# EAGLE design Toggle_Switch_Hub (EAGLE 7.6.0)

## Sheet 1 of 2
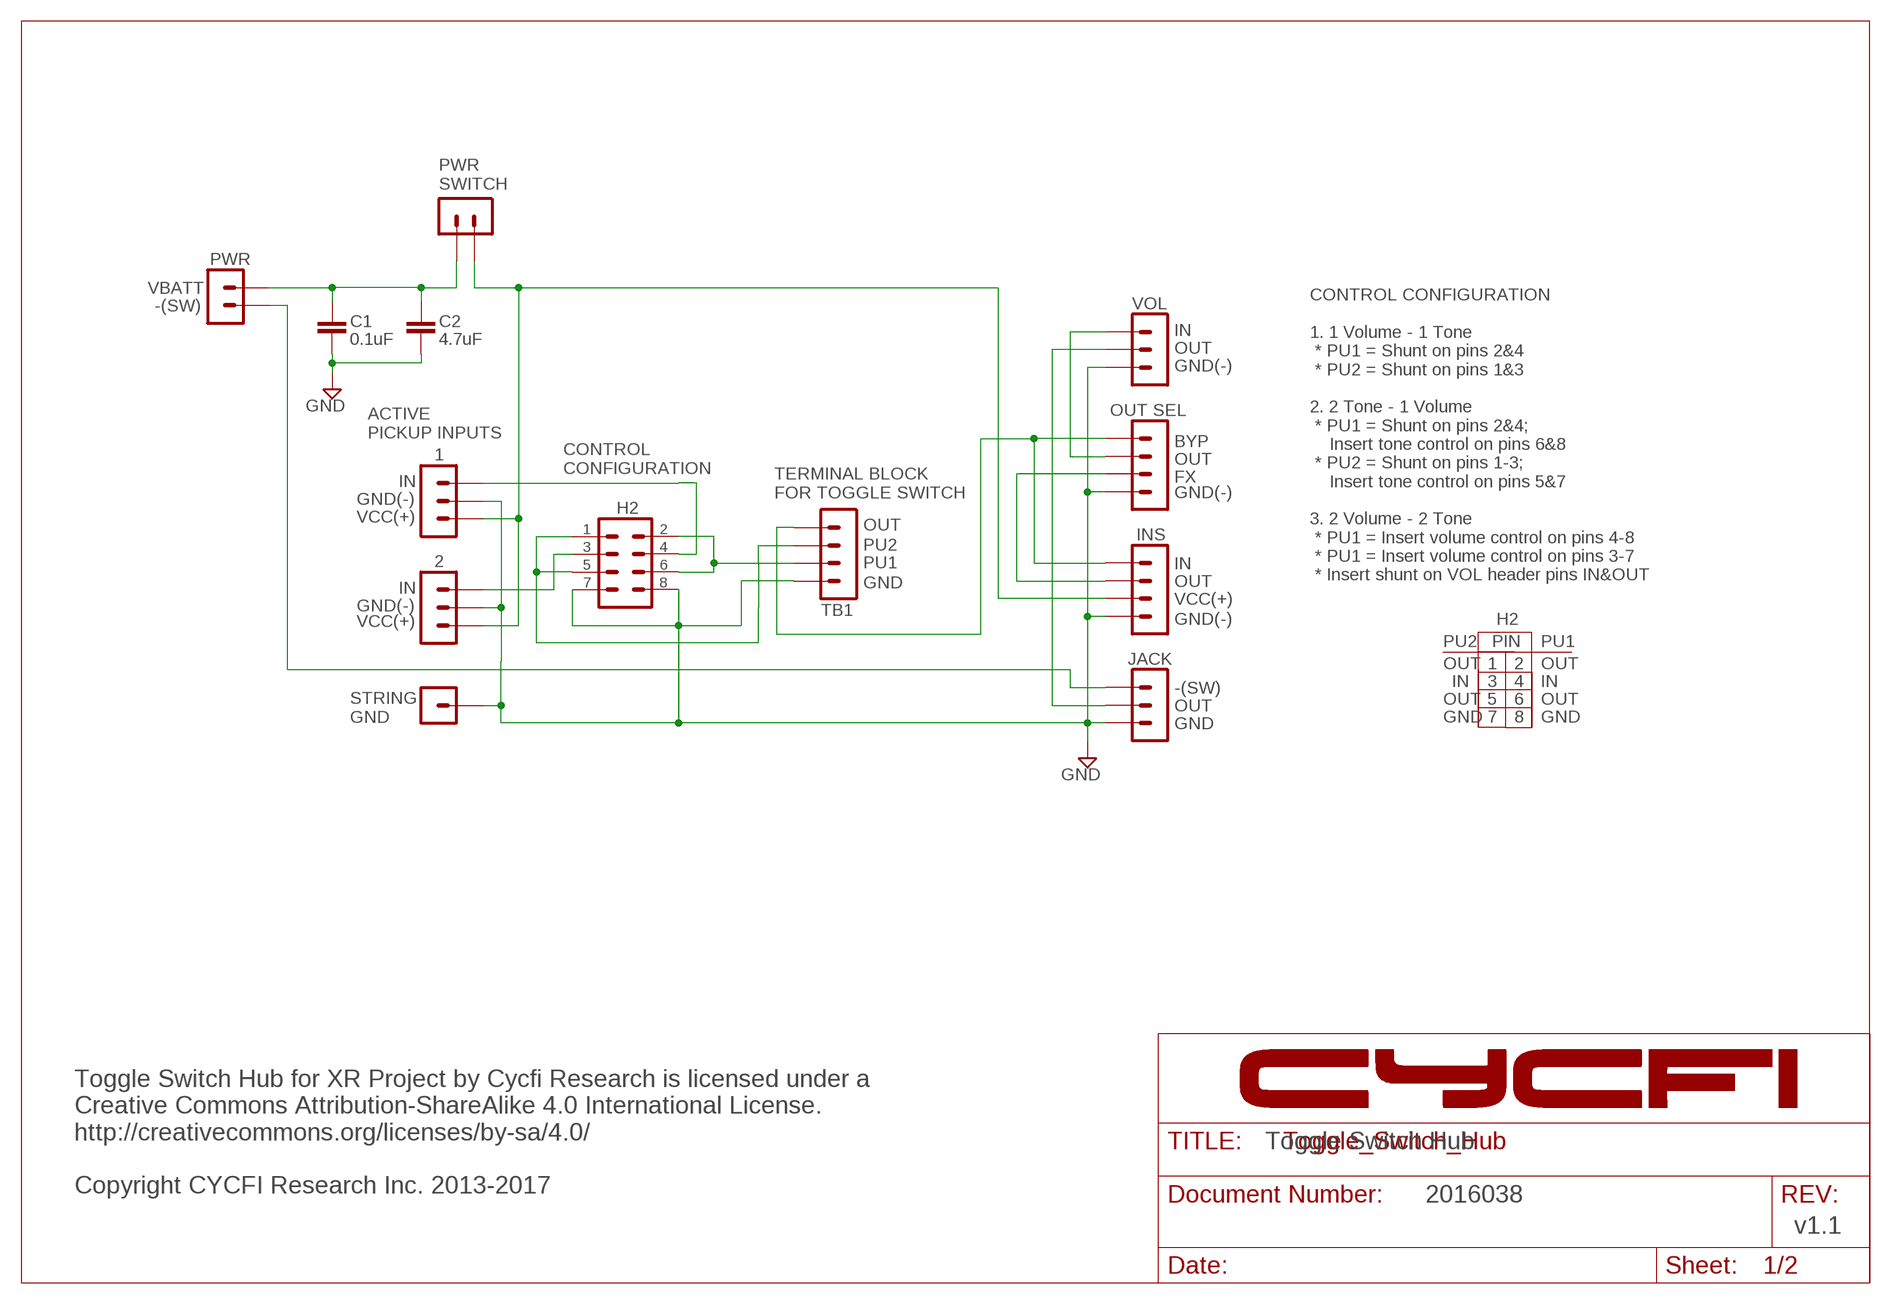
[diagram p0: schematic, sheet 1]

### Parts
C1  0.1uF  C-EUC0603  [C0603]
C2  4.7uF  C-EUC0603  [C0603]
H2  MA04-2  [MA04-2]
TB1  282837-4_TERMINAL_BLOCK  [TERMINAL_BLOCK_4P_5.08MM]

### Nets
BYP: TB1.P$4 ; also sheet 2
GND: C1.2 C2.2 H2.7 H2.8 TB1.P$1 ; also sheet 2
N$6: H2.2 H2.6 TB1.P$2
N$8: H2.1 H2.5 TB1.P$3
PU1: H2.4 ; also sheet 2
PU2: H2.3 ; also sheet 2
VCC: C1.1 C2.1 ; also sheet 2

### Notes on the sheet
- PWR
  SWITCH
- PWR
- VBATT
- -(SW) | VOL
- IN
- OUT
- GND(-)
- OUT SEL
- ACTIVE
  PICKUP INPUTS
- BYP
- 1 | OUT
- CONTROL 
  CONFIGURATION
- IN | FX
- TERMINAL BLOCK
  FOR TOGGLE SWITCH
- GND(-)
- GND(-)
- VCC(+) | OUT
- PU2 | INS
- PU1
- 2 | IN
- GND
- CONTROL CONFIGURATION
  
  1. 1 Volume - 1 Tone 
   * PU1 = Shunt on pins 2&4
   * PU2 = Shunt on pins 1&3
  
  2. 2 Tone - 1 Volume
   * PU1 = Shunt on pins 2&4; 
      Insert tone control on pins 6&8 
   * PU2 = Shunt on pins 1-3;
      Insert tone control on pins 5&7
  
  3. 2 Volume - 2 Tone
   * PU1 = Insert volume control on pins 4-8 
   * PU1 = Insert volume control on pins 3-7
   * Insert shunt on VOL header pins IN&OUT
- OUT
- IN
- VCC(+)
- GND(-) | TB1
- VCC(+) | GND(-) | H2
- PU2 | PIN | PU1
- JACK | OUT | 1 | 2 | OUT
- IN | 3 | 4 | IN
- -(SW)
- OUT | 5 | 6 | OUT
- OUT
- STRING 
  GND
- GND | 7 | 8 | GND
- GND
- Toggle Switch Hub
- Toggle Switch Hub for XR Project by Cycfi Research is licensed under a 
  Creative Commons Attribution-ShareAlike 4.0 International License. 
  http://creativecommons.org/licenses/by-sa/4.0/ 
  
  Copyright CYCFI Research Inc. 2013-2017
- 2016038
- v1.1

## Sheet 2 of 2
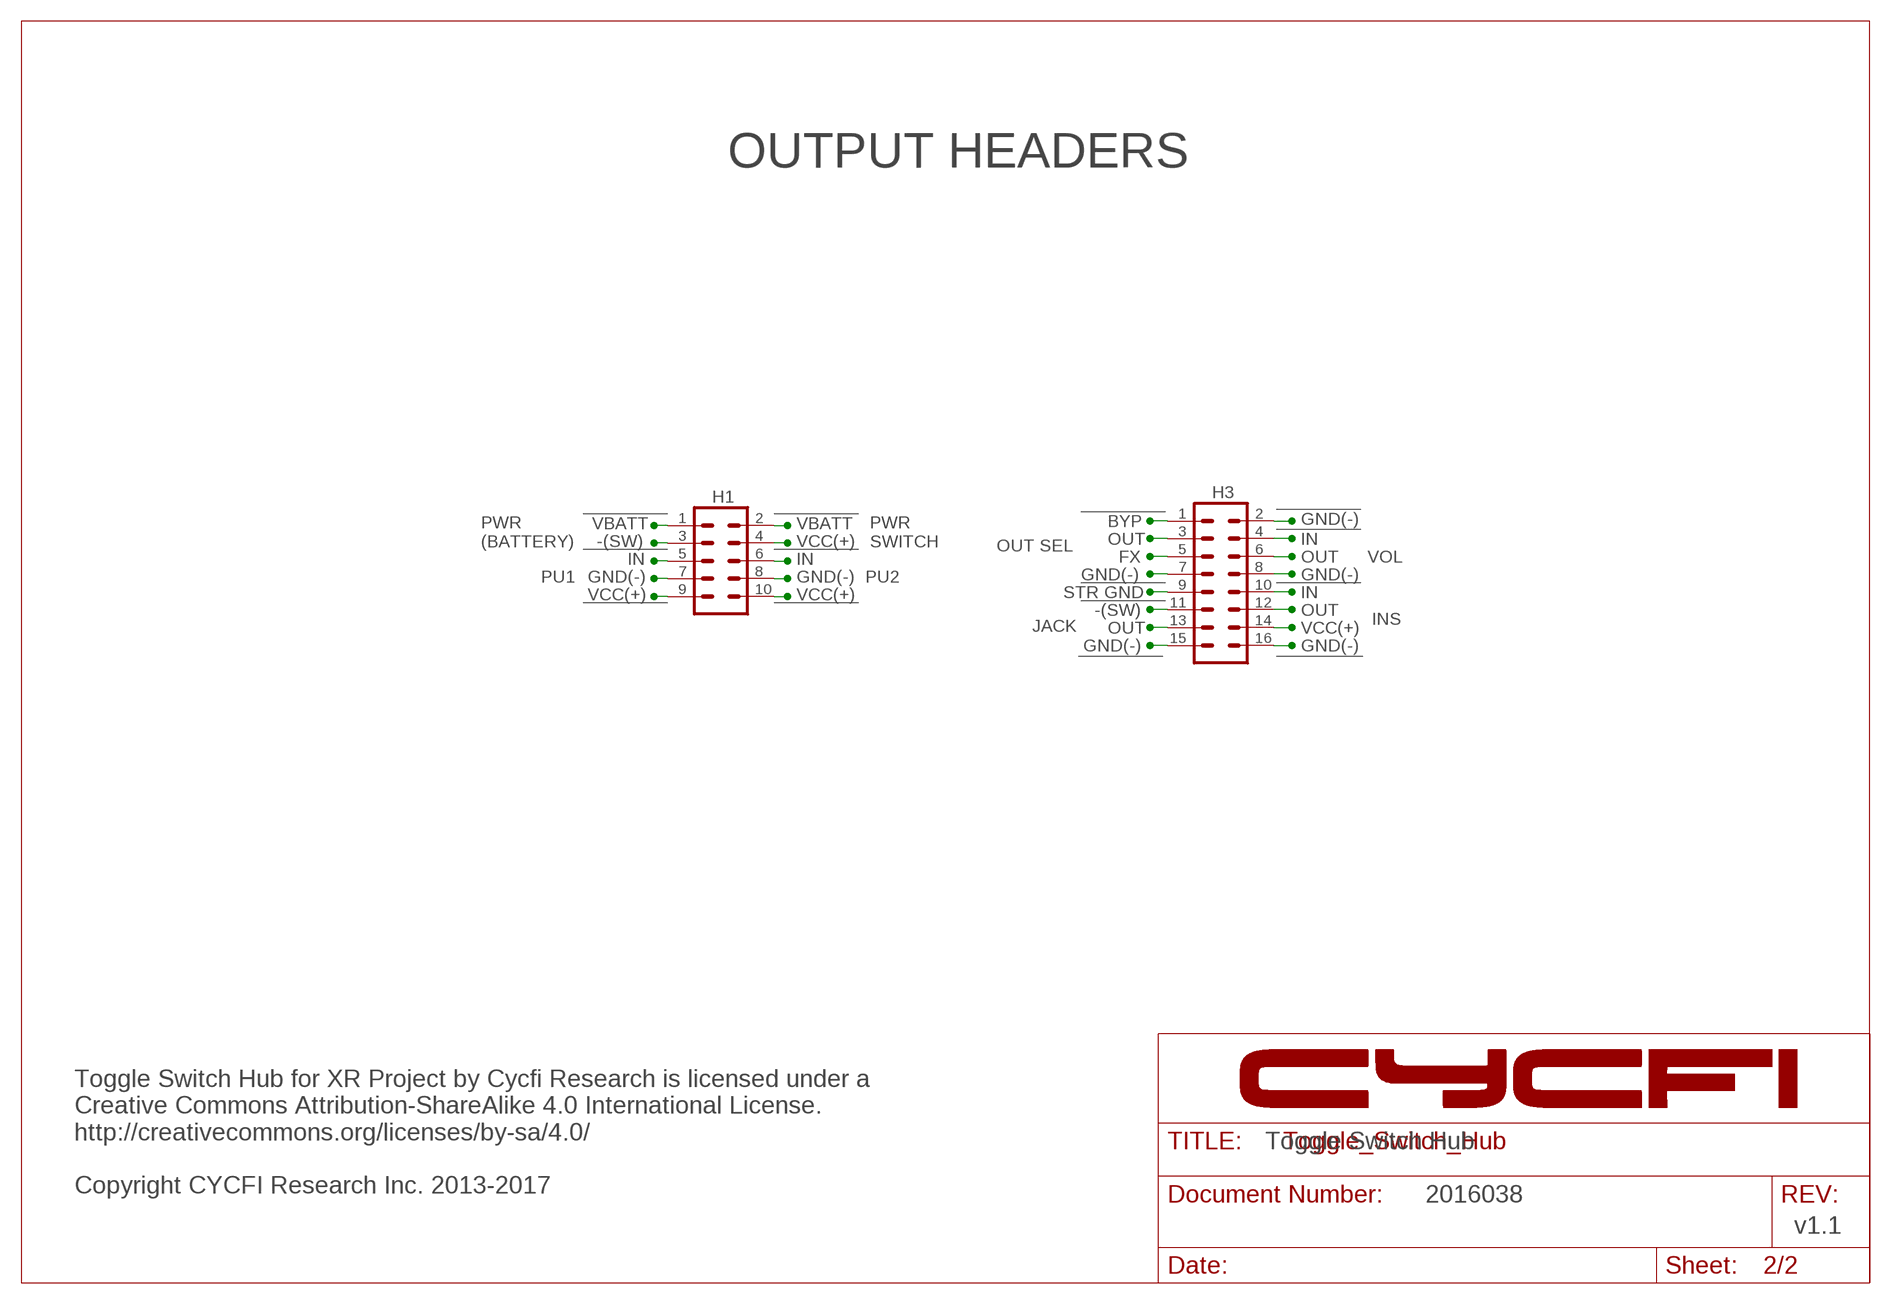
[diagram p1: schematic, sheet 2]

### Parts
H1  MA05-2  [MA05-2]
H3  MA08-2  [MA08-2]

### Nets
BYP: H3.1 H3.10 ; also sheet 1
FX: H3.5 H3.12 ; also sheet 1
GND: H1.7 H1.8 H3.2 H3.7 H3.8 H3.9 H3.15 H3.16 ; also sheet 1
OUT: H3.3 H3.4 ; also sheet 1
OUT(VOL): H3.6 H3.13 ; also sheet 1
PU1: H1.5 ; also sheet 1
PU2: H1.6 ; also sheet 1
SW: H1.3 H3.11 ; also sheet 1
VCC: H1.1 H1.2 ; also sheet 1
VIN: H1.4 H1.9 H1.10 H3.14 ; also sheet 1

### Notes on the sheet
- OUTPUT HEADERS
- VBATT | VBATT | BYP | GND(-)
- OUT | IN
- PWR
  (BATTERY)
- -(SW) | VCC(+)
- PWR 
  SWITCH
- OUT SEL
- IN | IN | FX | OUT | VOL
- PU1 | GND(-) | GND(-) | PU2 | GND(-) | GND(-)
- VCC(+) | VCC(+) | STR GND | IN
- -(SW) | OUT
- INS
- JACK | OUT | VCC(+)
- GND(-) | GND(-)
- Toggle Switch Hub
- Toggle Switch Hub for XR Project by Cycfi Research is licensed under a 
  Creative Commons Attribution-ShareAlike 4.0 International License. 
  http://creativecommons.org/licenses/by-sa/4.0/ 
  
  Copyright CYCFI Research Inc. 2013-2017
- 2016038
- v1.1

## Library data of the parts
C1 C2 = resistor:C-EU: CAPACITOR, European symbol
H1 = con-lstb:MA05-2: PIN HEADER; OC_FARNELL: unknown; OC_NEWARK: unknown
H2 = con-lstb:MA04-2: PIN HEADER; OC_FARNELL: unknown; OC_NEWARK: unknown
H3 = con-lstb:MA08-2: PIN HEADER; OC_FARNELL: unknown; OC_NEWARK: unknown
TB1 = CYCFI_Con:282837-4_TERMINAL_BLOCK

## Board
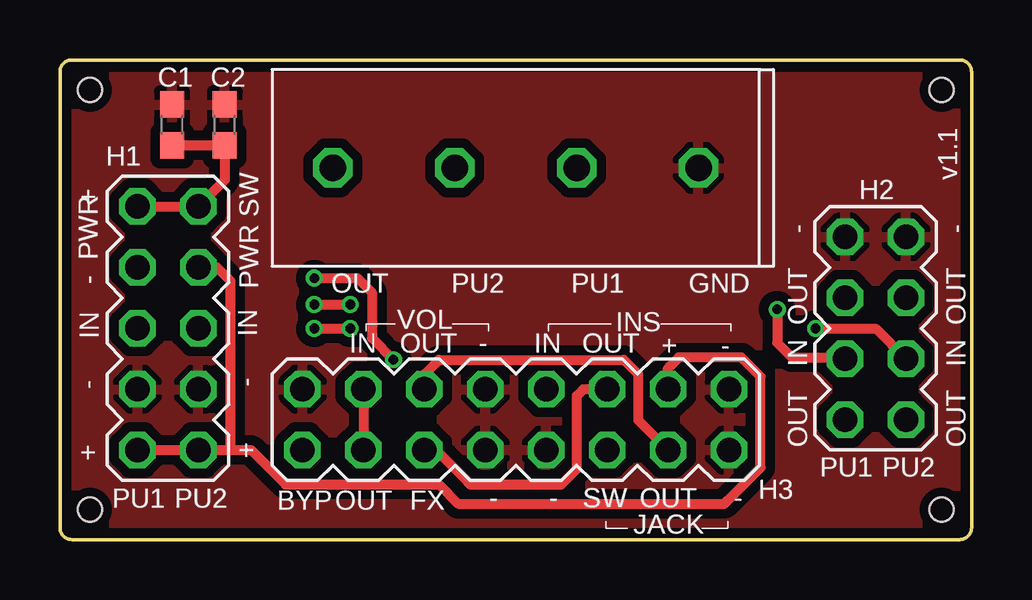
[diagram p2: board, top side]
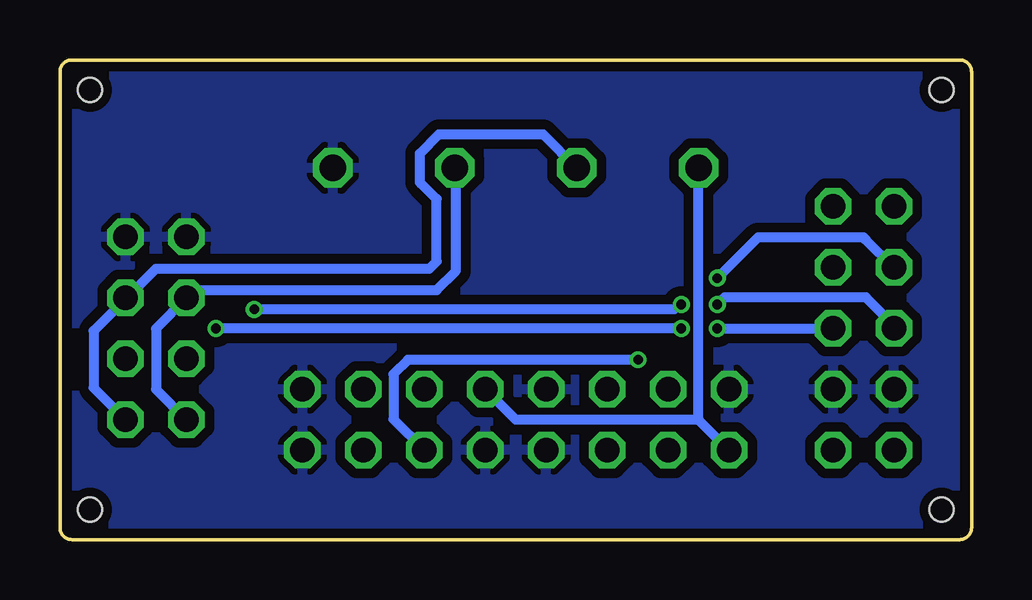
[diagram p3: board, bottom side, seen from below]

Size 38 x 20 mm. Coordinates in mm from the lower left corner, seen from the top.
Outline: 37.5,0 0.5,0 arc-90 0,0.5 0,19.5 arc-90 0.5,20 37.5,20 arc-90 38,19.5 38,0.5 arc-90 37.5,0
Copper layers (1*16): Top 0.035mm / dielectric 1.5mm / Bottom 0.035mm
Design rules "Fusion_eagle_rule_v1.1": minimum track width 6mil, minimum drill 12mil, track to track 6mil, track to pad 6mil, pad to pad 6mil, via to via 6mil, smd to smd 0mil, copper to edge 10mil, drill to drill 10mil, minimum pad ring 10mil, minimum via ring 6mil, stop-mask expansion 2mil, vias tented up to drill 100mil, thermal gap 10mil
Holes 1 mm at 1.25,18.75 1.25,1.25 36.75,1.25 36.75,18.75

### Footprints (pad centres in the part's own frame; a part is rotated, then mirrored left to right if it is on the bottom)
C0603 = smd 1.1 x 1: 1 -0.85,0; 2 0.85,0
MA05-2 = drill 1.016 octagon: 1 -5.08,-1.27; 2 -5.08,1.27; 3 -2.54,-1.27; 4 -2.54,1.27; 5 0,-1.27; 6 0,1.27; 7 2.54,-1.27; 8 2.54,1.27; 9 5.08,-1.27; 10 5.08,1.27
MA04-2 = drill 1.016 octagon: 1 -3.81,-1.27; 2 -3.81,1.27; 3 -1.27,-1.27; 4 -1.27,1.27; 5 1.27,-1.27; 6 1.27,1.27; 7 3.81,-1.27; 8 3.81,1.27
MA08-2 = drill 1.016 octagon: 1 -8.89,-1.27; 2 -8.89,1.27; 3 -6.35,-1.27; 4 -6.35,1.27; 5 -3.81,-1.27; 6 -3.81,1.27; 7 -1.27,-1.27; 8 -1.27,1.27; 9 1.27,-1.27; 10 1.27,1.27; 11 3.81,-1.27; 12 3.81,1.27; 13 6.35,-1.27; 14 6.35,1.27; 15 8.89,-1.27; 16 8.89,1.27
TERMINAL_BLOCK_4P_5.08MM = drill 1.1 octagon: P$1 -7.62,0; P$2 -2.54,0; P$3 2.54,0; P$4 7.62,0

### Placement (x,y rotation side)
C1  4.67,17.29 90 top
C2  6.87,17.29 90 top
H1  4.5,8.81 270 top
H2  34,8.81 90 top
H3  19,5 0 top
TB1  19,15.5 180 top

### Tracks (layer width: path | path; a pad name or v marks a point on that pad's centre or on a via)
BYP
  Bottom 0.406: 11.4,5 11.3,4.9 10.13,3.73 H3.1 | 11.4,5 19,5 H3.10 | 11.4,5 11.38,5.02 TB1.P$4
FX
  Top 0.406: H3.12 21.82,6.27 21.8,6.25 21.55,6 21.55,2.95 21.5,2.9 20.9,2.3 17.1,2.3 17,2.4 15.67,3.73 H3.5
GND
  pour Top (isolate 0.406): 37.5,0 0.5,0 arc-90 0,0.5 0,19.5 arc-90 0.5,20 37.5,20 arc-90 38,19.5 38,0.5 arc-90
  pour Bottom (isolate 0.406): 37.5,0 0.5,0 arc-90 0,0.5 0,19.5 arc-90 0.5,20 37.5,20 arc-90 38,19.5 38,0.5 arc-90
N$6
  Bottom 0.406: H2.2 34,6.27 34,8.8 H2.6 32.4,10.4 22.3,10.4 21.5,11.2 21.5,15.46 TB1.P$2
N$8
  Bottom 0.406: H2.1 36.6,6.33 36.6,8.7 36.5,8.8 35.27,10.03 H2.5 35.22,10.08 34,11.3 22.6,11.3 22.3,11.6 22.3,14.2 22.9,14.8 23,14.9 23,16.1 22.2,16.9 17.86,16.9 TB1.P$3
OUT
  Top 0.406: H3.4 H3.3
OUT(VOL)
  Top 0.406: H3.6 15.19,6.11 H3.6 | H3.6 15.19,6.89 15.8,7.5 23.5,7.5 24.1,6.9 24.1,4.98 H3.13
PU1  (via drill 0.4)
  Top 0.406: v10.6,9.8 v12.1,9.8 | v29.9,9.6 29.9,8.2 30.5,7.6 32.67,7.6 H2.4
  Bottom 0.406: v10.6,9.8 10.3,10.1 4.4,10.1 3.23,8.93 H1.5 | v29.9,9.6 12.4,9.6 12.2,9.8 v12.1,9.8
PU2  (via drill 0.4)
  Top 0.406: v10.6,8.8 v12.1,8.8 | v31.5,8.8 34.01,8.8 H2.3
  Bottom 0.406: v10.6,8.8 10.5,8.8 10.49,8.81 H1.6 | v12.1,8.8 v31.5,8.8
SW  (via drill 0.4)
  Top 0.406: v10.6,10.9 12.4,10.9 13,10.3 13,8.4 v13.9,7.5
  Bottom 0.406: H1.3 3.25,11.35 4.4,12.5 4.5,12.6 8.9,12.6 v10.6,10.9 | v13.9,7.5 23.5,7.5 24.1,6.9 24.1,5.02 H3.11
VCC
  Top 0.406: C1.1 C2.1 6.87,14.99 H1.2 H1.1
VIN
  Top 0.406: H1.4 6.55,11.35 7.1,10.8 7.1,5.06 7.1,3.73 | 7.1,3.73 7.97,3.73 9.4,2.3 15.8,2.3 16.6,1.5 27.7,1.5 28,1.8 | 27.8,1.6 28,1.8 | 28,1.8 29.2,3 29.2,6.8 28.4,7.6 25.8,7.6 25.4,7.2 25.35,7.15 H3.14 | H1.9 H1.10 7.1,3.73

### Text on the board
tNames: v1.1 | + | - | - | PWR | - | OUT | OUT | IN | IN | PWR SW | OUT | PU2 | VOL | PU1 | INS | GND | IN | OUT | - | IN | OUT | + | - | IN | IN | - | - | OUT | OUT | + | + | PU1 | PU2 | BYP | OUT | FX | - | - | SW | OUT | - | PU1 | PU2 | JACK
_tNames: C1 | C2 | H1 | v1.1 | + | H2 | - | - | PWR | - | OUT | OUT | IN | IN | PWR SW | OUT | PU2 | VOL | PU1 | INS | GND | IN | OUT | - | IN | OUT | + | - | IN | IN | - | - | OUT | OUT | + | + | PU1 | PU2 | BYP | OUT | FX | - | - | SW | OUT | - | H3 | PU1 | PU2 | JACK